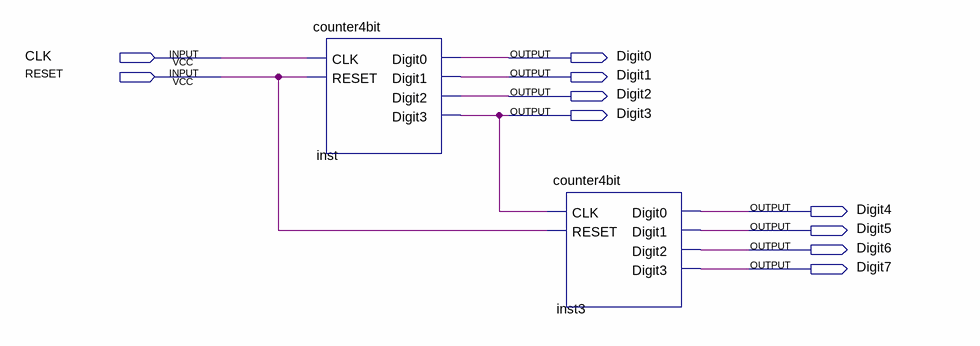
[diagram p0: schematic sheet]
// Quartus schematic counter8bit.bdf as structural Verilog: 2 symbols, 10 pins
module counter8bit (
  input  CLK,
  input  RESET,
  output Digit0,
  output Digit1,
  output Digit2,
  output Digit3,
  output Digit4,
  output Digit5,
  output Digit6,
  output Digit7
);

  counter4bit inst (.CLK(CLK), .RESET(RESET), .Digit0(Digit0), .Digit1(Digit1), .Digit2(Digit2), .Digit3(Digit3));
  counter4bit inst3 (.CLK(Digit3), .RESET(RESET), .Digit0(Digit4), .Digit1(Digit5), .Digit2(Digit6), .Digit3(Digit7));
endmodule
